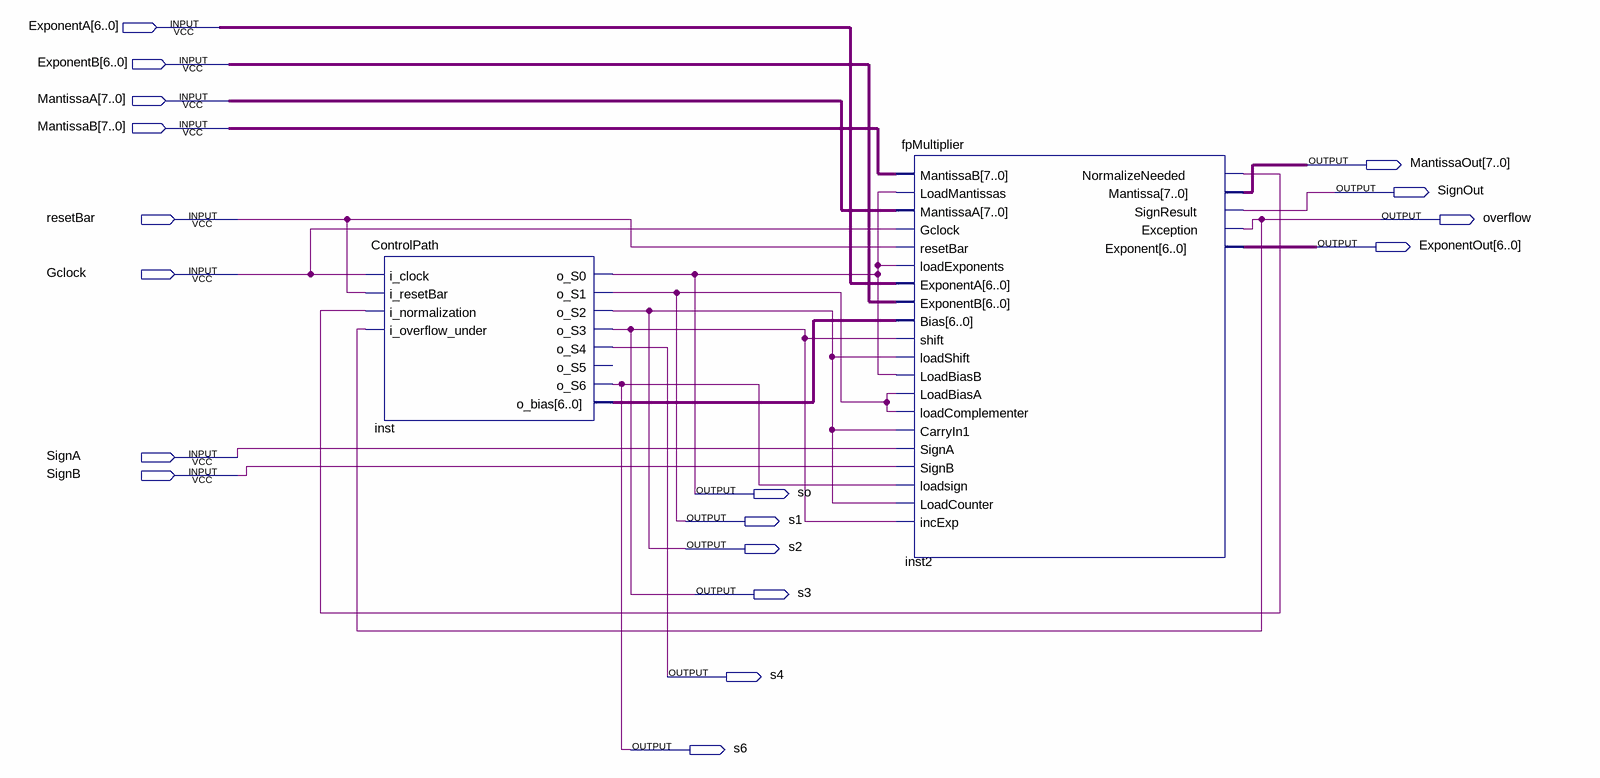
[diagram p0: schematic sheet]
// Quartus schematic toplevelmMULT.bdf as structural Verilog: 2 symbols, 18 pins
module toplevelmMULT (
  input  [6:0] ExponentA,
  input  [6:0] ExponentB,
  input  [7:0] MantissaA,
  input  [7:0] MantissaB,
  input  resetBar,
  input  Gclock,
  input  SignA,
  input  SignB,
  output [7:0] MantissaOut,
  output SignOut,
  output overflow,
  output [6:0] ExponentOut,
  output so,
  output s1,
  output s2,
  output s3,
  output s4,
  output s6
);

  wire inst2_normalizeneeded;
  wire [6:0] inst_o_bias;

  ControlPath inst (
    .i_clock(Gclock), .i_resetBar(resetBar), .i_normalization(inst2_normalizeneeded),
    .i_overflow_under(overflow), .o_S0(so), .o_S1(s1), .o_S2(s2), .o_S3(s3), .o_S4(s4), .o_S6(s6),
    .o_bias(inst_o_bias));  // open: o_S5
  fpMultiplier inst2 (
    .MantissaB(MantissaB), .LoadMantissas(so), .MantissaA(MantissaA), .Gclock(Gclock), .resetBar(resetBar),
    .loadExponents(so), .ExponentA(ExponentA), .ExponentB(ExponentB), .Bias(inst_o_bias), .shift(s3),
    .loadShift(s2), .LoadBiasB(so), .LoadBiasA(s1), .loadComplementer(s1), .CarryIn1(s2), .SignA(SignA),
    .SignB(SignB), .loadsign(s6), .LoadCounter(s2), .incExp(s3), .NormalizeNeeded(inst2_normalizeneeded),
    .Mantissa(MantissaOut), .SignResult(SignOut), .Exception(overflow), .Exponent(ExponentOut));
endmodule
